# Altium schematic sheet Controller+USB.SchDoc
size A4; Organization: Altium Limited; Address1: L3, 12a Rodborough Rd; Address2: Frenchs Forest; Address3: NSW; Address4: Australia 2086
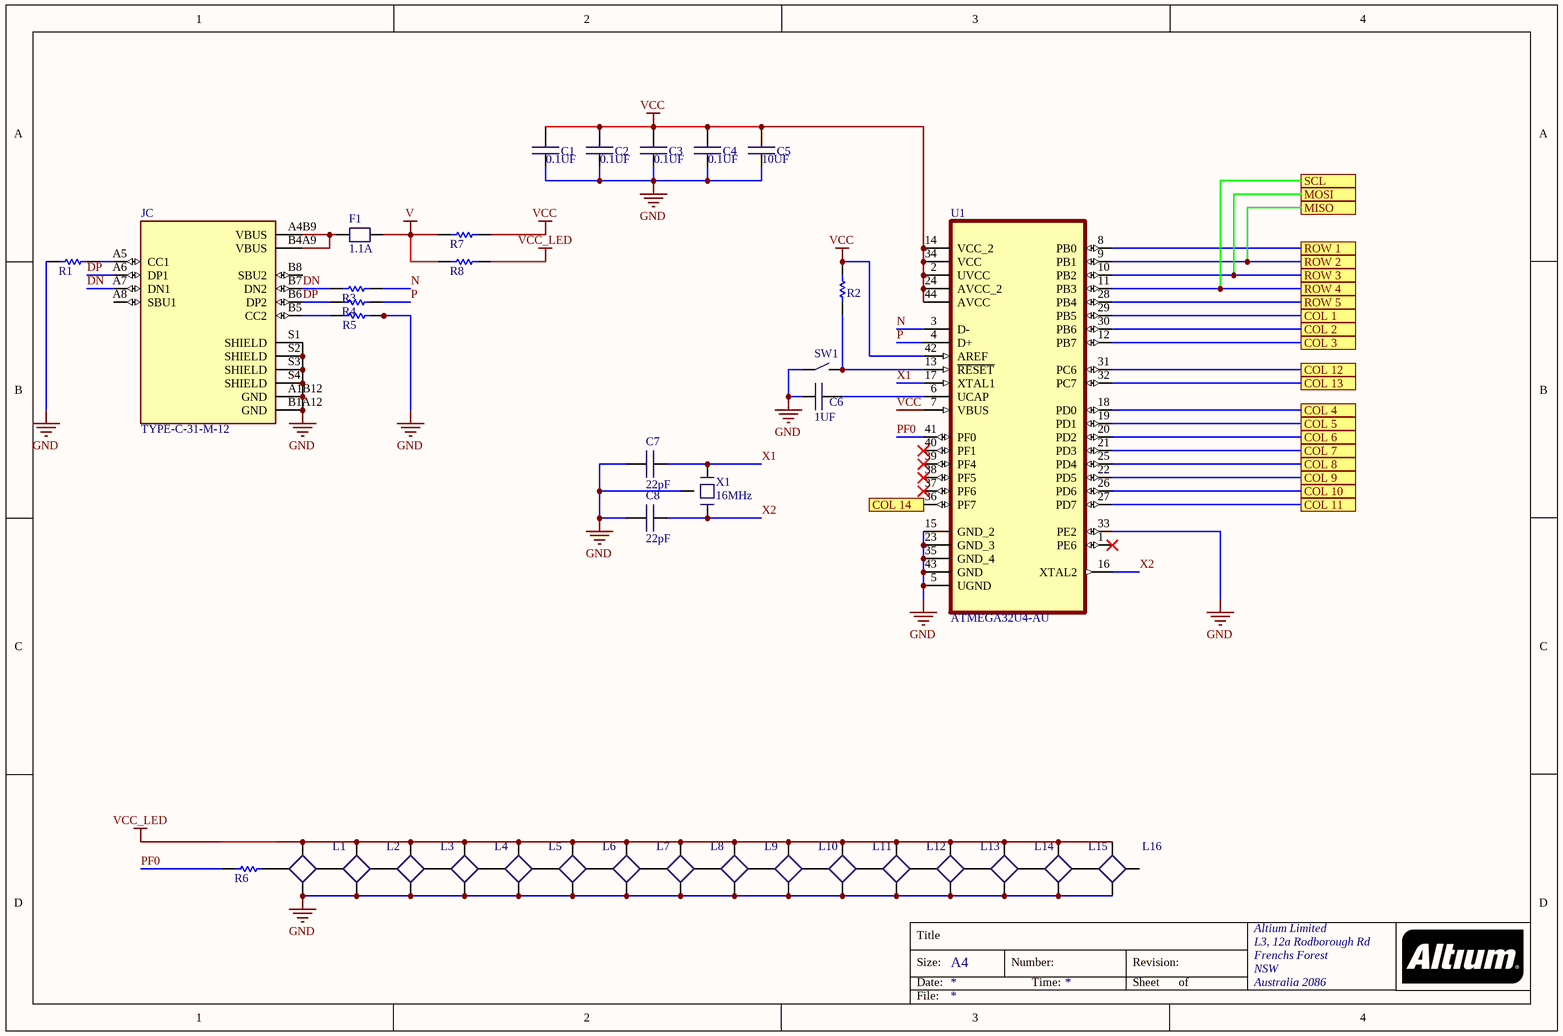
[diagram p0: Controller+USB.SchDoc]

## Parts
C1  0.1UF  [C0402]
C2  0.1UF  [C0402]
C3  0.1UF  [C0402]
C4  0.1UF  [C0402]
C5  10UF  [C0402]
C6  1UF  [C0402]
C7  22pF  [C0402]
C8  22pF  [C0402]
F1  1.1A  [F1206]
JC  TYPE-C-31-M-12  [HRO_TYPE-C-31-M-12]
L1  WS2812B3535  [Neopixel3535]  (value not drawn)
L2  WS2812B3535  [Neopixel3535]  (value not drawn)
L3  WS2812B3535  [Neopixel3535]  (value not drawn)
L4  WS2812B3535  [Neopixel3535]  (value not drawn)
L5  WS2812B3535  [Neopixel3535]  (value not drawn)
L6  WS2812B3535  [Neopixel3535]  (value not drawn)
L7  WS2812B3535  [Neopixel3535]  (value not drawn)
L8  WS2812B3535  [Neopixel3535]  (value not drawn)
L9  WS2812B3535  [Neopixel3535]  (value not drawn)
L10  WS2812B3535  [Neopixel3535]  (value not drawn)
L11  WS2812B3535  [Neopixel3535]  (value not drawn)
L12  WS2812B3535  [Neopixel3535]  (value not drawn)
L13  WS2812B3535  [Neopixel3535]  (value not drawn)
L14  WS2812B3535  [Neopixel3535]  (value not drawn)
L15  WS2812B3535  [Neopixel3535]  (value not drawn)
L16  WS2812B3535  [Neopixel3535]  (value not drawn)
R1  resistor  [R0402]  (value not drawn)
R2  resistor  [R0402]  (value not drawn)
R3  resistor  [R0402]  (value not drawn)
R4  resistor  [R0402]  (value not drawn)
R5  resistor  [R0402]  (value not drawn)
R6  resistor  [R0402]  (value not drawn)
R7  0 Ohm  [R0402]  (value not drawn)
R8  0 Ohm  [R0402]  (value not drawn)
SW1  Switch_Tactile_EVP  [SW_EVP-BB2A9B000]  (value not drawn)
U1  ATMEGA32U4-AU  [QFPN_ATMEGA32U4-44N]
X1  16MHz  [CRYSTAL-3.2X2.5]

## Ports
COL 1, COL 2, COL 3, COL 4, COL 5, COL 6, COL 7, COL 8, COL 9, COL 10, COL 11, COL 12, COL 13, COL 14, MISO, MOSI, ROW 1, ROW 2, ROW 3, ROW 4, ROW 5, SCL

## Nets
GND: C1.1 C2.1 C3.1 C4.1 C5.1 C6.1 C7.2 C8.2 JC.A1B12(GND) JC.B1A12(GND) JC.S1(SHIELD) JC.S2(SHIELD) JC.S3(SHIELD) JC.S4(SHIELD) L1.3-GND(GND) L2.3-GND(GND) L3.3-GND(GND) L4.3-GND(GND) L5.3-GND(GND) L6.3-GND(GND) L7.3-GND(GND) L8.3-GND(GND) L9.3-GND(GND) L10.3-GND(GND) L11.3-GND(GND) L12.3-GND(GND) L13.3-GND(GND) L14.3-GND(GND) L15.3-GND(GND) L16.3-GND(GND) R1.1 R5.2 SW1.A U1.5(UGND) U1.15(GND_2) U1.23(GND_3) U1.33(PE2) U1.35(GND_4) U1.43(GND) X1.2,_4
V: F1.2 R7.1 R8.1
VCC: C1.2 C2.2 C3.2 C4.2 C5.2 R2.2 R7.2 U1.2(UVCC) U1.7(VBUS) U1.14(VCC_2) U1.24(AVCC_2) U1.34(VCC) U1.42(AREF) U1.44(AVCC)
VCC_LED: L1.1-VDD(VDD) L2.1-VDD(VDD) L3.1-VDD(VDD) L4.1-VDD(VDD) L5.1-VDD(VDD) L6.1-VDD(VDD) L7.1-VDD(VDD) L8.1-VDD(VDD) L9.1-VDD(VDD) L10.1-VDD(VDD) L11.1-VDD(VDD) L12.1-VDD(VDD) L13.1-VDD(VDD) L14.1-VDD(VDD) L15.1-VDD(VDD) L16.1-VDD(VDD) R8.2
COL 1: U1.29(PB5) ; port COL 1
COL 2: U1.30(PB6) ; port COL 2
COL 3: U1.12(PB7) ; port COL 3
COL 4: U1.18(PD0) ; port COL 4
COL 5: U1.19(PD1) ; port COL 5
COL 6: U1.20(PD2) ; port COL 6
COL 7: U1.21(PD3) ; port COL 7
COL 8: U1.25(PD4) ; port COL 8
COL 9: U1.22(PD5) ; port COL 9
COL 10: U1.26(PD6) ; port COL 10
COL 11: U1.27(PD7) ; port COL 11
COL 12: U1.31(PC6) ; port COL 12
COL 13: U1.32(PC7) ; port COL 13
COL 14: U1.36(PF7) ; port COL 14
DN: JC.A7(DN1) JC.B7(DN2) R3.1
DP: JC.A6(DP1) JC.B6(DP2) R4.1
MISO: U1.9(PB1) ; port ROW 2, port MISO
MOSI: U1.10(PB2) ; port ROW 3, port MOSI
N: R3.2 U1.3(D-)
P: R4.2 U1.4(D+)
PF0: R6.2 U1.41(PF0)
ROW 1: U1.8(PB0) ; port ROW 1
ROW 4: U1.11(PB3) ; port ROW 4, port SCL
ROW 5: U1.28(PB4) ; port ROW 5
X1: C7.1 U1.17(XTAL1) X1.1
X2: C8.1 U1.16(XTAL2) X1.3
NetC6_2: C6.2 U1.6(UCAP)
NetF1_1: F1.1 JC.A4B9(VBUS) JC.B4A9(VBUS)
NetJC_A5: JC.A5(CC1) R1.2
NetJC_B5: JC.B5(CC2) R5.1
NetL1_2-DOUT: L1.2-DOUT(DOUT) L2.4-DIN(DIN)
NetL1_4-DIN: L1.4-DIN(DIN) R6.1
NetL2_2-DOUT: L2.2-DOUT(DOUT) L3.4-DIN(DIN)
NetL3_2-DOUT: L3.2-DOUT(DOUT) L4.4-DIN(DIN)
NetL4_2-DOUT: L4.2-DOUT(DOUT) L5.4-DIN(DIN)
NetL5_2-DOUT: L5.2-DOUT(DOUT) L6.4-DIN(DIN)
NetL6_2-DOUT: L6.2-DOUT(DOUT) L7.4-DIN(DIN)
NetL7_2-DOUT: L7.2-DOUT(DOUT) L8.4-DIN(DIN)
NetL8_2-DOUT: L8.2-DOUT(DOUT) L9.4-DIN(DIN)
NetL9_2-DOUT: L9.2-DOUT(DOUT) L10.4-DIN(DIN)
NetL10_2-DOUT: L10.2-DOUT(DOUT) L11.4-DIN(DIN)
NetL11_2-DOUT: L11.2-DOUT(DOUT) L12.4-DIN(DIN)
NetL12_2-DOUT: L12.2-DOUT(DOUT) L13.4-DIN(DIN)
NetL13_2-DOUT: L13.2-DOUT(DOUT) L14.4-DIN(DIN)
NetL14_2-DOUT: L14.2-DOUT(DOUT) L15.4-DIN(DIN)
NetL15_2-DOUT: L15.2-DOUT(DOUT) L16.4-DIN(DIN)
NetR2_1: R2.1 SW1.B U1.13(~{RESET})

Not connected (* = marked no-connect by the designer): JC A8(SBU1) B8(SBU2); L16 2-DOUT(DOUT); U1 1(PE6)* 37(PF6)* 38(PF5)* 39(PF4)* 40(PF1)*

## Notes on the sheet
- Title
- Size:
- Date:
- A4
- Number:
- Time:
- Revision:
- Sheet
- of
- File:

## Library data of the parts
C1-C8 = C0402
F1 = Fuse 1206
JC = TYPE-C-31-M-12: USB Connectors 24 Receptacle 1 8.94*7.3mm RoHS; MF: HRO Electronics Co., Ltd.; Value: *; SnapEDA_Link: https://www.snapeda.com/parts/TYPE-C-31-M-12/HRO%20Electronics%20Co.,%20Ltd./view-part/3228496/?ref=snap; Package: Package; MP: TYPE-C-31-M-12; Price: None; Availability: Unavailable
L1-L16 = WS2812B3535: MF: SparkFun Electronics; Availability: Unavailable; SnapEDA_Link: https://www.snapeda.com/parts/WS2812B/Worldsemi/view-part/1038297/?ref=snap; MP: WS2812B; Price: None; Value: *; Package: None
R5 = resistor: 5.1k
R7 R8 = resistor
U1 = ATMEGA32U4-AU: AVR AVRÂ® ATmega Microcontroller IC 8-Bit 16MHz 32KB _16K x 16_ FLASH 44-TQFP _10x10_; MF: Microchip Technology; Value: *; SnapEDA_Link: https://www.snapeda.com/parts/ATMEGA32U4-AU/Microchip/view-part/4251478/?ref=snap; MP: ATMEGA32U4-AU; Availability: Unavailable; Price: None; Package: TQFP-44 Microchip Technology
X1 = Crystal 3x2.5